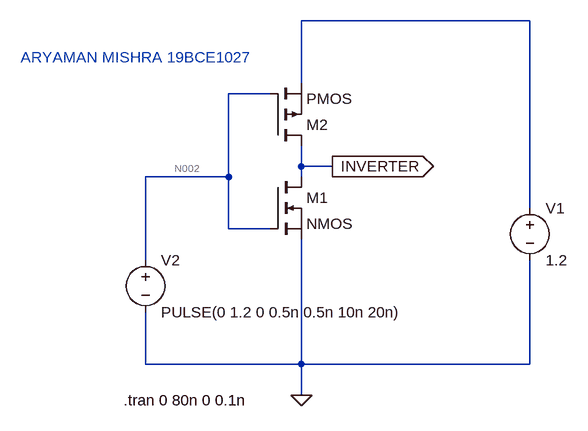
[diagram p0: schematic T1(1).asc]
T1(1).asc, the LTspice schematic file:
Version 4
SHEET 1 880 680
WIRE 560 -160 208 -160
WIRE 208 -64 208 -160
WIRE 160 -48 96 -48
WIRE 208 64 208 32
WIRE 256 64 208 64
WIRE 96 80 96 -48
WIRE 96 80 -32 80
WIRE 208 80 208 64
WIRE 560 128 560 -160
WIRE 96 160 96 80
WIRE 160 160 96 160
WIRE -32 208 -32 80
WIRE -32 368 -32 288
WIRE 208 368 208 176
WIRE 208 368 -32 368
WIRE 560 368 560 208
WIRE 560 368 208 368
WIRE 208 416 208 368
FLAG 256 64 INVERTER
IOPIN 256 64 Out
FLAG 208 416 0
SYMBOL nmos 160 80 R0
SYMATTR InstName M1
SYMBOL voltage 560 112 R0
WINDOW 123 0 0 Left 0
WINDOW 39 0 0 Left 0
SYMATTR InstName V1
SYMATTR Value 1.2
SYMBOL voltage -32 192 R0
WINDOW 123 0 0 Left 0
WINDOW 39 0 0 Left 0
SYMATTR InstName V2
SYMATTR Value PULSE(0 1.2 0 0.5n 0.5n 10n 20n)
SYMBOL pmos 160 32 M180
SYMATTR InstName M2
TEXT -66 424 Left 2 !.tran 0 80n 0 0.1n
TEXT -224 -104 Left 2 ;ARYAMAN MISHRA 19BCE1027

The netlist it stands for:
* T1(1).asc
M1 INVERTER N002 0 0 NMOS
V1 N001 0 1.2
V2 N002 0 PULSE(0 1.2 0 0.5n 0.5n 10n 20n)
M2 INVERTER N002 N001 N001 PMOS
.model NMOS NMOS
.model PMOS PMOS
.lib standard.mos
.tran 0 80n 0 0.1n
* ARYAMAN MISHRA 19BCE1027
.backanno
.end

* Results of the author's LTspice run, read from the files saved beside the schematic
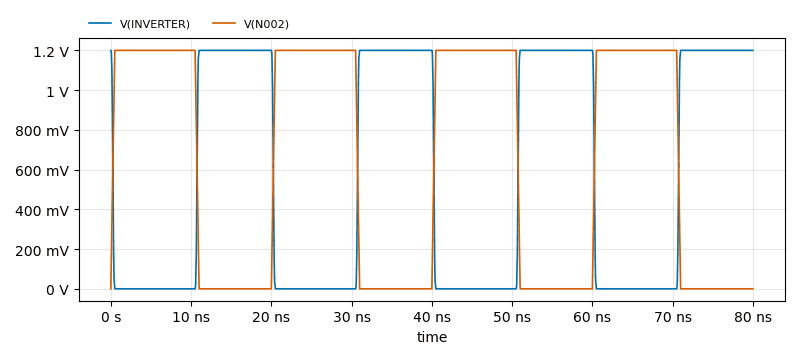
[diagram p1: Transient Analysis of T1(1).asc, plotted from the saved traces]
* Transient Analysis, 1 run:
*   V(INVERTER): min 0 V, max 1.2 V, average 570.1 mV, rms 823 mV, last 1.2 V
*   V(N002): min 0 V, max 1.2 V, average 630 mV, rms 862.8 mV, last 0 V